# Altium schematic sheet M2_Power.SchDoc
size A3; SheetNumber: 2; SheetTotal: 5
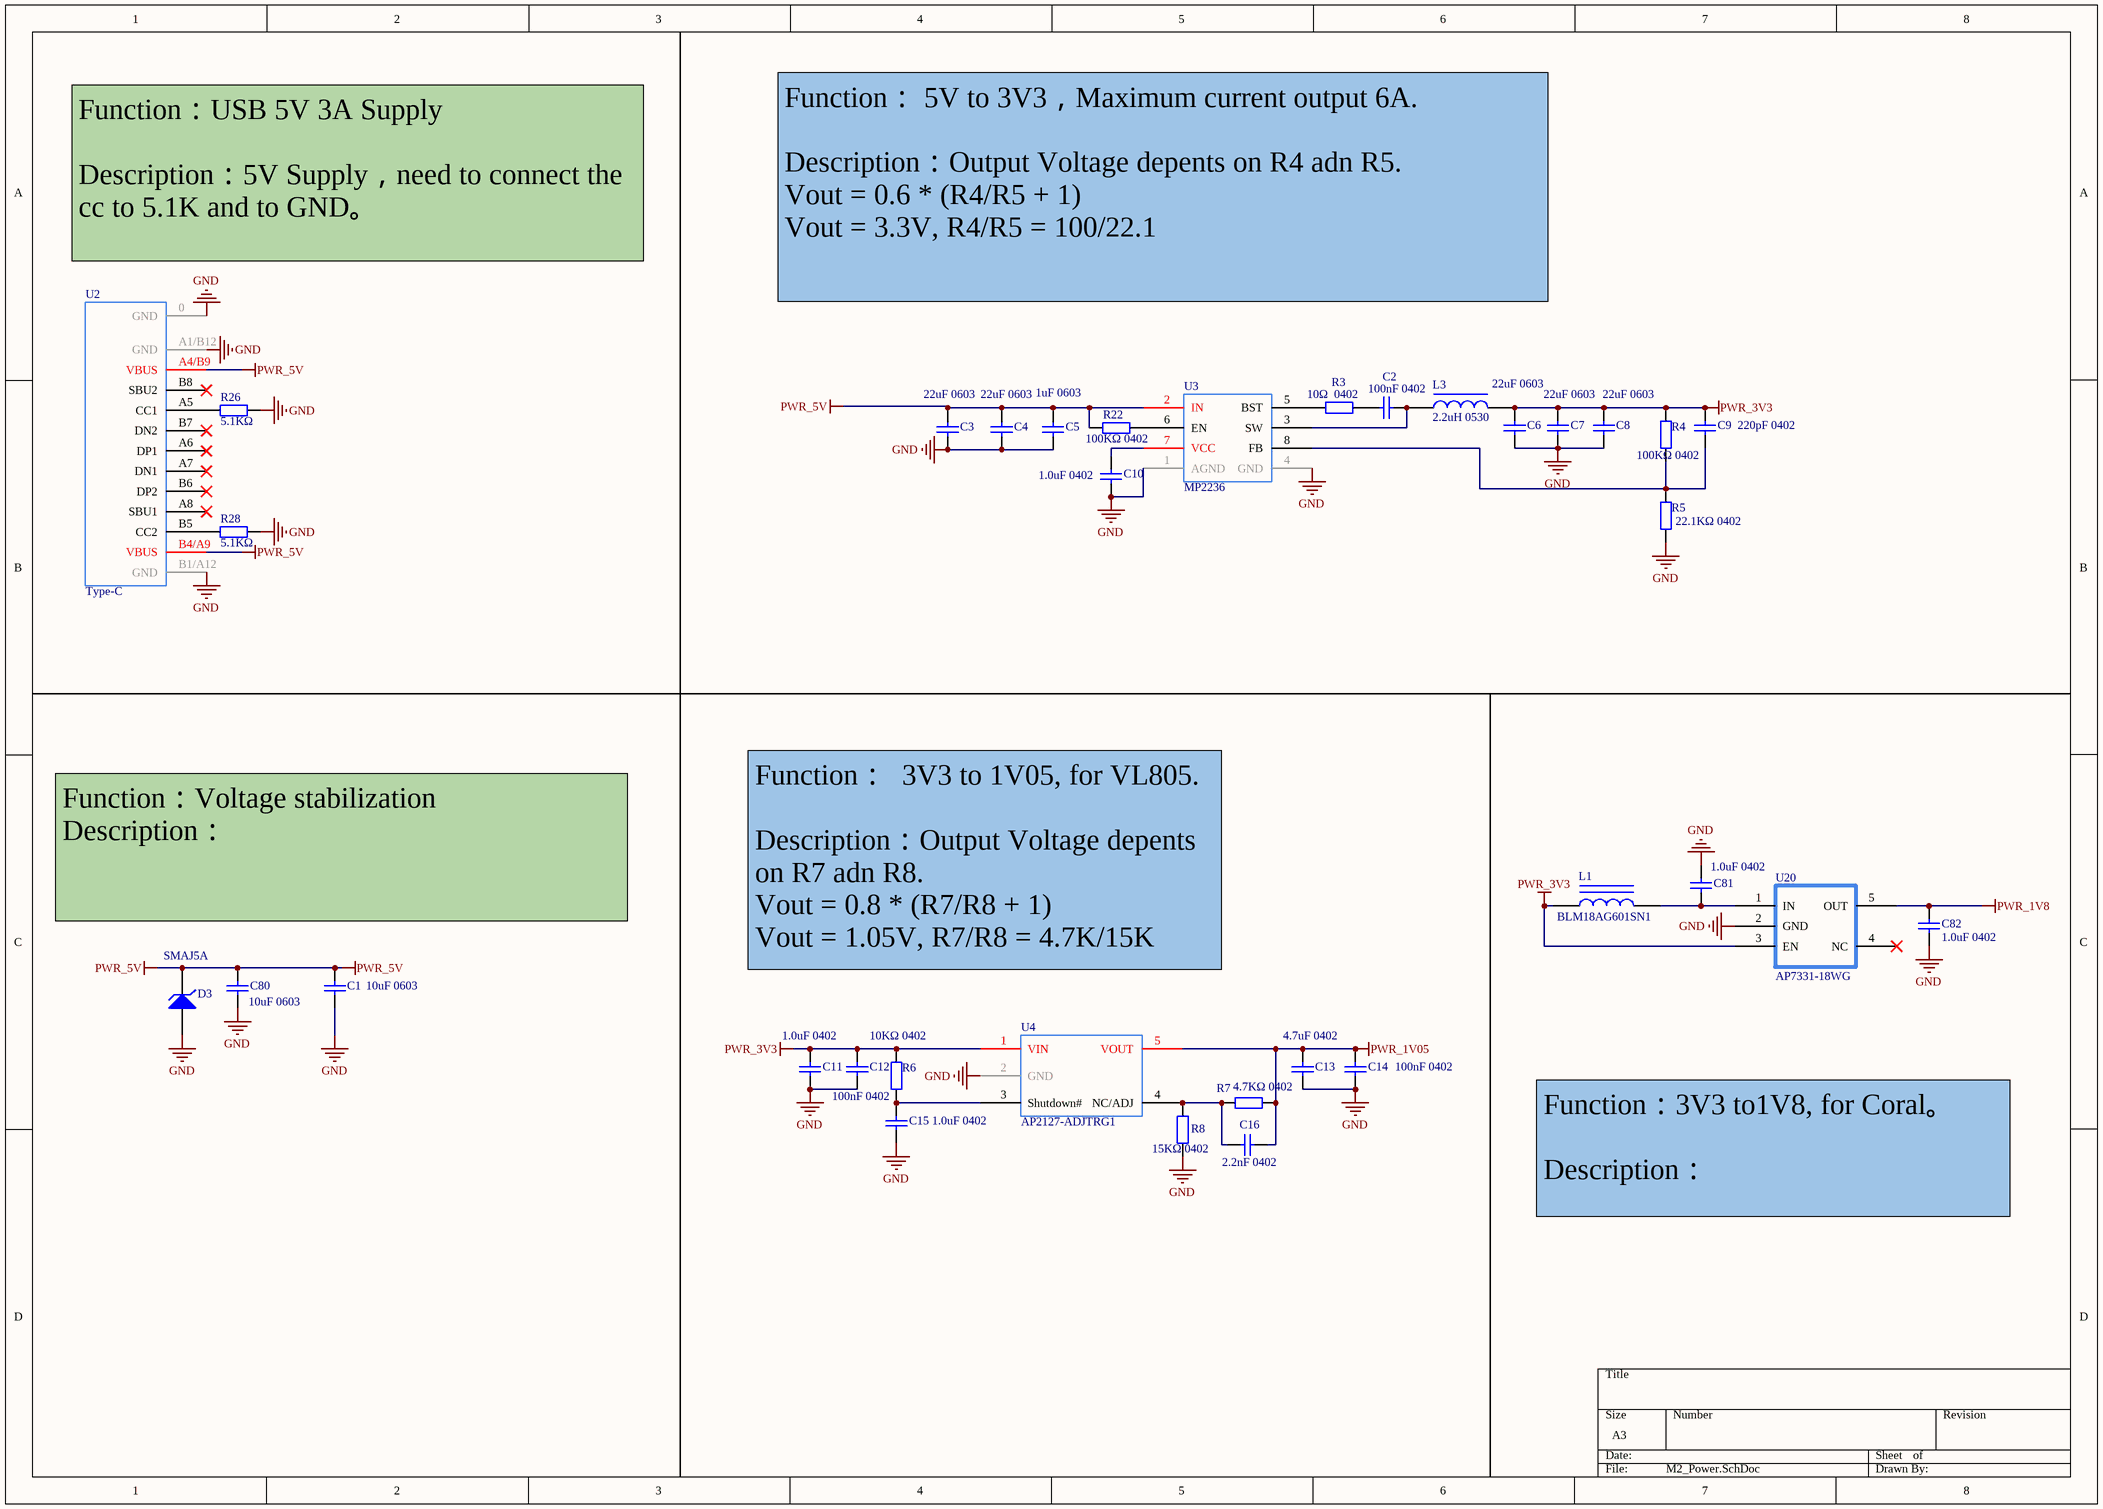
[diagram p0: M2_Power.SchDoc]

## Parts
C1  10uF 0603  [0603_C]
C2  100nF 0402  [0402_C]
C3  22uF 0603  [0603_C]
C4  22uF 0603  [0603_C]
C5  1uF 0603  [0603_C]
C6  22uF 0603  [0603_C]
C7  22uF 0603  [0603_C]
C8  22uF 0603  [0603_C]
C9  220pF 0402  [0402_C]
C10  1.0uF 0402  [0402_C]
C11  1.0uF 0402  [0402_C]
C12  100nF 0402  [0402_C]
C13  4.7uF 0402  [0402_C]
C14  100nF 0402  [0402_C]
C15  1.0uF 0402  [0402_C]
C16  2.2nF 0402  [0402_C]
C80  10uF 0603  [0603_C]
C81  1.0uF 0402  [0402_C]
C82  1.0uF 0402  [0402_C]
D3  SMAJ5A  [SMAJ5A]
L1  BLM18AG601SN1  [0603_L]
L3  2.2uH 0530  [0530]
R3  10Ω  0402  [0402_R]
R4  100KΩ 0402  [0402_R]
R5  22.1KΩ 0402  [0402_R]
R6  10KΩ 0402  [0402_R]
R7  4.7KΩ 0402  [0402_R]
R8  15KΩ 0402  [0402_R]
R22  100KΩ 0402  [0402_R]
R26  5.1KΩ  [0402_R]
R28  5.1KΩ  [0402_R]
U2  Type-C  [Type-C-16P]
U3  MP2236  [MP2236]
U4  AP2127-ADJTRG1  [AP2127K]
U20  AP7331-18WG  [AP7331-18WG]

## Nets
GND: C1.1 C3.1 C4.1 C5.1 C6.1 C7.1 C8.1 C10.1 C11.1 C12.1 C13.1 C14.1 C15.1 C80.1 C81.1 C82.1 D3.1(A) R5.1 R8.1 R26.2 R28.2 U2.0(GND) U2.A1/B12(GND) U2.B1/A12(GND) U3.1(AGND) U3.4(GND) U4.2(GND) U20.2(GND)
PWR_1V05: C13.2 C14.2 C16.2 R7.2 U4.5(VOUT)
PWR_1V8: C82.2 U20.5(OUT)
PWR_3V3: C6.2 C7.2 C8.2 C9.2 C11.2 C12.2 L1.1 L3.2 R4.2 R6.2 U4.1(VIN) U20.3(EN)
PWR_5V: C1.2 C3.2 C4.2 C5.2 C80.2 D3.2(C) R22.1 U2.A4/B9(VBUS) U2.B4/A9(VBUS) U3.2(IN)
NetC2_1: C2.1 R3.2
NetC2_2: C2.2 L3.1 U3.3(SW)
NetC9_1: C9.1 R4.1 R5.2 U3.8(FB)
NetC10_2: C10.2 U3.7(VCC)
NetC15_2: C15.2 R6.1 U4.3(Shutdown#)
NetC16_1: C16.1 R7.1 R8.2 U4.4(NC/ADJ)
NetC81_2: C81.2 L1.2 U20.1(IN)
NetR3_1: R3.1 U3.5(BST)
NetR22_2: R22.2 U3.6(EN)
NetR26_1: R26.1 U2.A5(CC1)
NetR28_1: R28.1 U2.B5(CC2)

Not connected (* = marked no-connect by the designer): U2 A6(DP1)* A7(DN1)* A8(SBU1)* B6(DP2)* B7(DN2)* B8(SBU2)*; U20 4(NC)*

## Notes on the sheet
- Function：USB 5V 3A Supply
  Description：5V Supply，need to connect the cc to 5.1K and to GND。
- Function： 5V to 3V3，Maximum current output 6A.
  Description：Output Voltage depents on R4 adn R5.
  Vout = 0.6 * (R4/R5 + 1)
  Vout = 3.3V, R4/R5 = 100/22.1
- Function：Voltage stabilization
  Description：
- Function：  3V3 to 1V05, for VL805.
  Description：Output Voltage depents on R7 adn R8.
  Vout = 0.8 * (R7/R8 + 1)
  Vout = 1.05V, R7/R8 = 4.7K/15K
- Function：3V3 to1V8, for Coral。
  Description：

## Library data of the parts
C1 C80 = 0603 10uF (106) 10% 10V: 贴片电容; ComponentLink1Description: 供应商链接; ComponentLink1URL: http://www.szlcsc.com/product/details_20411.html; Package: 0603; Supplier: LC; SuppliersPartNumber: C19702
C2 C12 C14 = 0402 100nF (104) 10% 16V: 贴片电容; ComponentLink1Description: 供应商链接; ComponentLink1URL: http://www.szlcsc.com/product/details_1877.html; Package: 0402; Supplier: LC; SuppliersPartNumber: C1525
C3 C4 C6-C8 = 0603 22uF (226) 20% 6.3V: 贴片电容; ComponentLink1Description: 供应商链接; ComponentLink1URL: http://www.szlcsc.com/product/details_60514.html; Package: 0603; Supplier: LC; SuppliersPartNumber: C59461
C5 = 0603 1uF (105) 10% 50V: 贴片电容; ComponentLink1Description: 供应商链接; ComponentLink1URL: http://www.szlcsc.com/product/details_16531.html; Package: 0603; Supplier: LC; SuppliersPartNumber: C15849
C9 = 0402 220pF (221) 10% 50V: 贴片电容; ComponentLink1Description: 供应商链接; ComponentLink1URL: http://www.szlcsc.com/product/details_1882.html; Package: 0402; Supplier: LC; SuppliersPartNumber: C1530
C10 C11 C15 C81 C82 = 0402 1.0uF (105) 10% 25V: 贴片电容; ComponentLink1Description: 供应商链接; ComponentLink1URL: http://www.szlcsc.com/product/details_53938.html; Package: 0402; Supplier: LC; SuppliersPartNumber: C52923
C13 = 0402 4.7uF (475) 20% 10V: 贴片电容; ComponentLink1Description: 供应商链接; ComponentLink1URL: http://www.szlcsc.com/product/details_24469.html; Package: 0402; Supplier: LC; SuppliersPartNumber: C23733
C16 = 0402 2.2nF (222) 10% 50V: 贴片电容; ComponentLink1Description: 供应商链接; ComponentLink1URL: http://www.szlcsc.com/product/details_1883.html; Package: 0402; Supplier: LC; SuppliersPartNumber: C1531
D3 = SMAJ5A: TVS
L1 = 0603 10uH 10%: 贴片电感; ComponentLink1Description: 供应商链接; ComponentLink1URL: http://www.szlcsc.com/product/details_1387.html; Package: 0603; Supplier: LC; SuppliersPartNumber: C1035
L3 = 2.2uH: 2.2uH 0630
R3 = 0402 10Ω (10R0) 1%: 贴片电阻; ComponentLink1Description: 供应商链接; ComponentLink1URL: http://www.szlcsc.com/product/details_25820.html; Package: 0402; Supplier: LC; SuppliersPartNumber: C25077
R4 R22 = 0402 100KΩ (1003) 1%: 贴片电阻; ComponentLink1Description: 供应商链接; ComponentLink1URL: http://www.szlcsc.com/product/details_26484.html; Package: 0402; Supplier: LC; SuppliersPartNumber: C25741
R5 R6 = 0402 10KΩ (1002) 1%: 贴片电阻; ComponentLink1Description: 供应商链接; ComponentLink1URL: http://www.szlcsc.com/product/details_26487.html; Package: 0402; Supplier: LC; SuppliersPartNumber: C25744
R7 = 0402 4.7KΩ (4701) 1%: 贴片电阻; ComponentLink1Description: 供应商链接; ComponentLink1URL: http://www.szlcsc.com/product/details_26643.html; Package: 0402; Supplier: LC; SuppliersPartNumber: C25900
R8 = 0402 15KΩ (1502) 1%: 贴片电阻; ComponentLink1Description: 供应商链接; ComponentLink1URL: http://www.szlcsc.com/product/details_26499.html; Package: 0402; Supplier: LC; SuppliersPartNumber: C25756
R26 R28 = 0402 5.1KΩ (5101) 1%: 贴片电阻; ComponentLink1Description: 供应商链接; ComponentLink1URL: http://www.szlcsc.com/product/details_26648.html; Package: 0402; Supplier: LC; SuppliersPartNumber: C25905
U2 = Type-C-16P
U3 = MP2236: Vin=18, Iout=6A
U4 = AP2127-ADJTRG1: 3.3V-1.05V
U20 = AP7331-18WG: Camera 1.8V